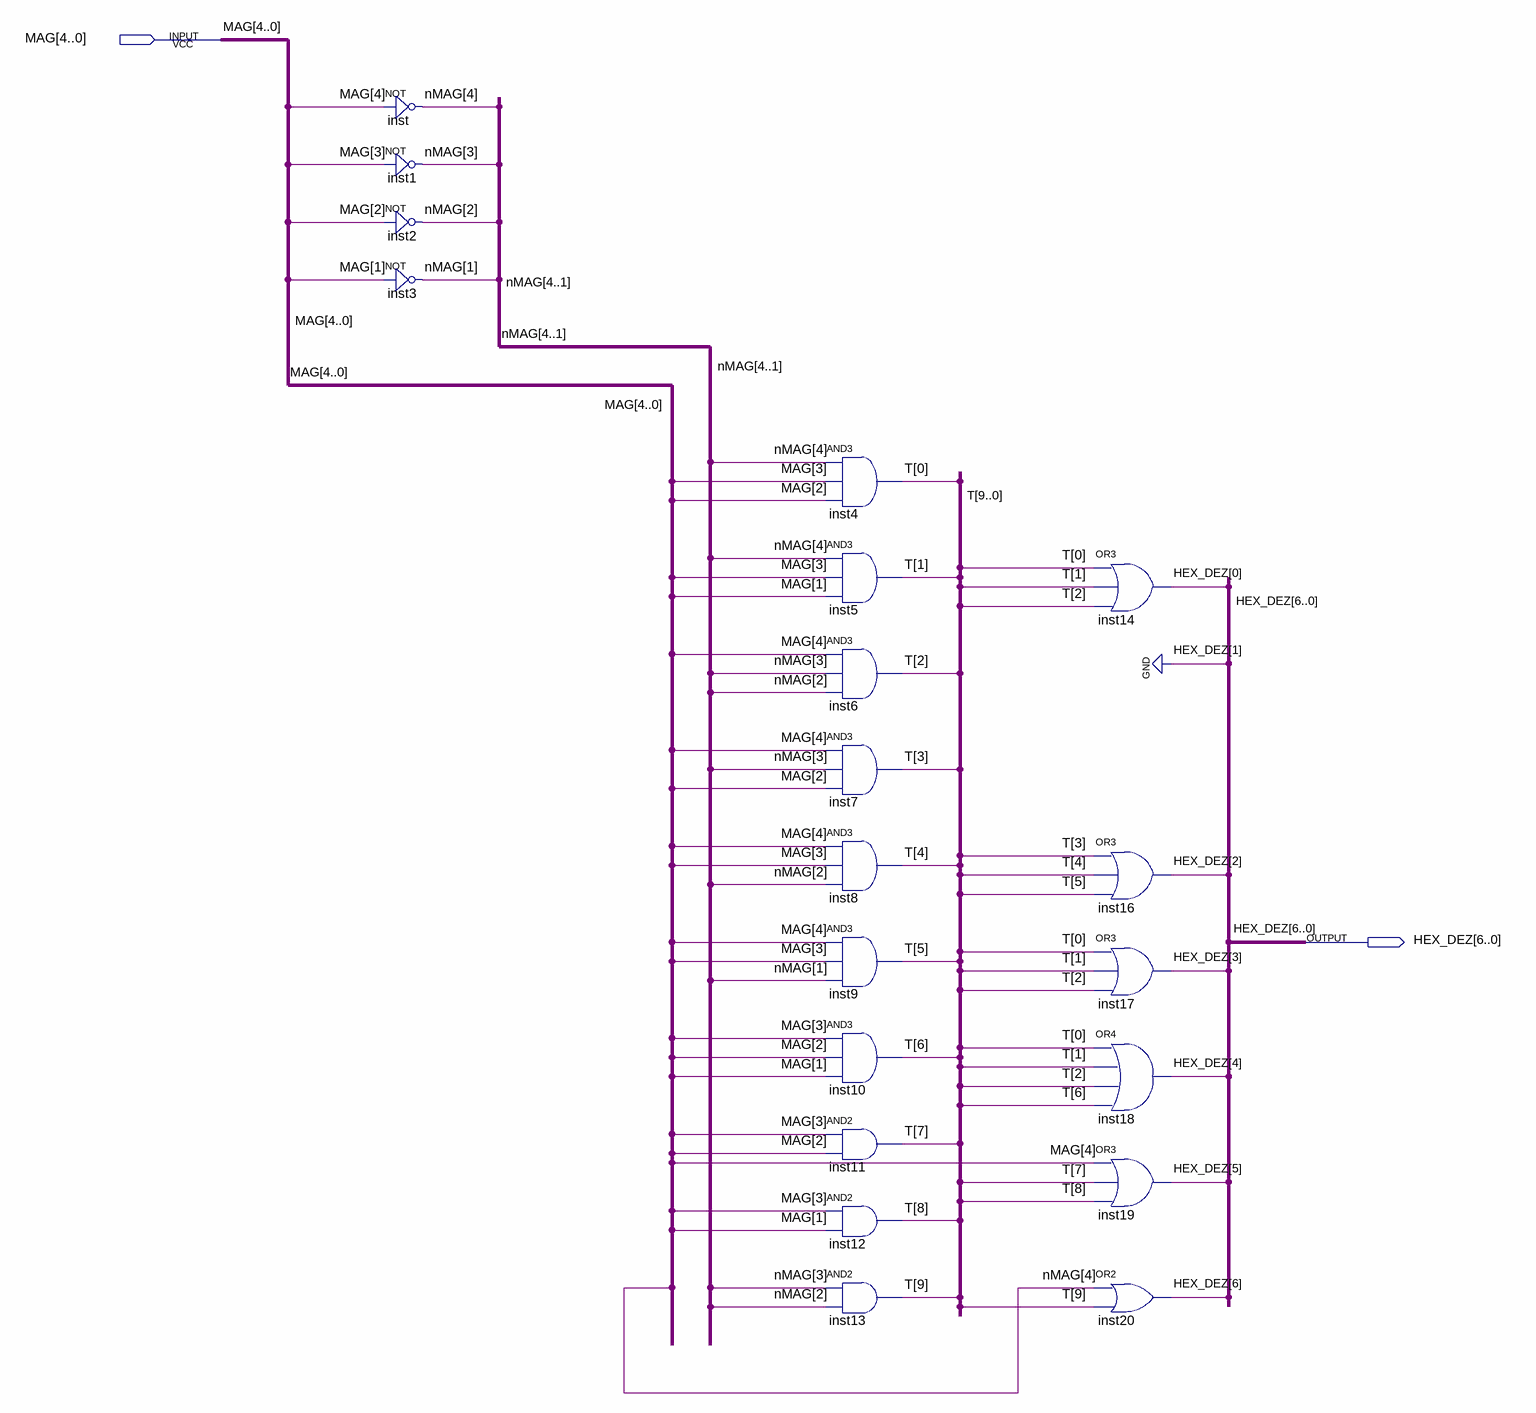
[diagram p0: schematic sheet]
// Quartus schematic decof7_dezena.bdf as structural Verilog: 20 symbols, 2 pins
module decof7_dezena (
  input  [4:0] MAG,
  output [6:0] HEX_DEZ
);

  wire [4:1] nMAG;
  wire [9:0] T;

  not inst (nMAG[4], MAG[4]);
  not inst1 (nMAG[3], MAG[3]);
  not inst2 (nMAG[2], MAG[2]);
  not inst3 (nMAG[1], MAG[1]);
  and inst4 (T[0], nMAG[4], MAG[3], MAG[2]);
  and inst5 (T[1], nMAG[4], MAG[3], MAG[1]);
  and inst6 (T[2], MAG[4], nMAG[3], nMAG[2]);
  and inst7 (T[3], MAG[4], nMAG[3], MAG[2]);
  and inst8 (T[4], MAG[4], MAG[3], nMAG[2]);
  and inst9 (T[5], MAG[4], MAG[3], nMAG[1]);
  and inst10 (T[6], MAG[3], MAG[2], MAG[1]);
  and inst11 (T[7], MAG[3], MAG[2]);
  and inst12 (T[8], MAG[3], MAG[1]);
  and inst13 (T[9], nMAG[3], nMAG[2]);
  or inst14 (HEX_DEZ[0], T[0], T[1], T[2]);
  or inst16 (HEX_DEZ[2], T[3], T[4], T[5]);
  or inst17 (HEX_DEZ[3], T[0], T[1], T[2]);
  or inst18 (HEX_DEZ[4], T[0], T[1], T[2], T[6]);
  or inst19 (HEX_DEZ[5], MAG[4], T[7], T[8]);
  or inst20 (HEX_DEZ[6], nMAG[4], T[9]);

  assign HEX_DEZ[1] = 1'b0;
endmodule
